# EAGLE design Zaliczeniowy (EAGLE 9.6.2)
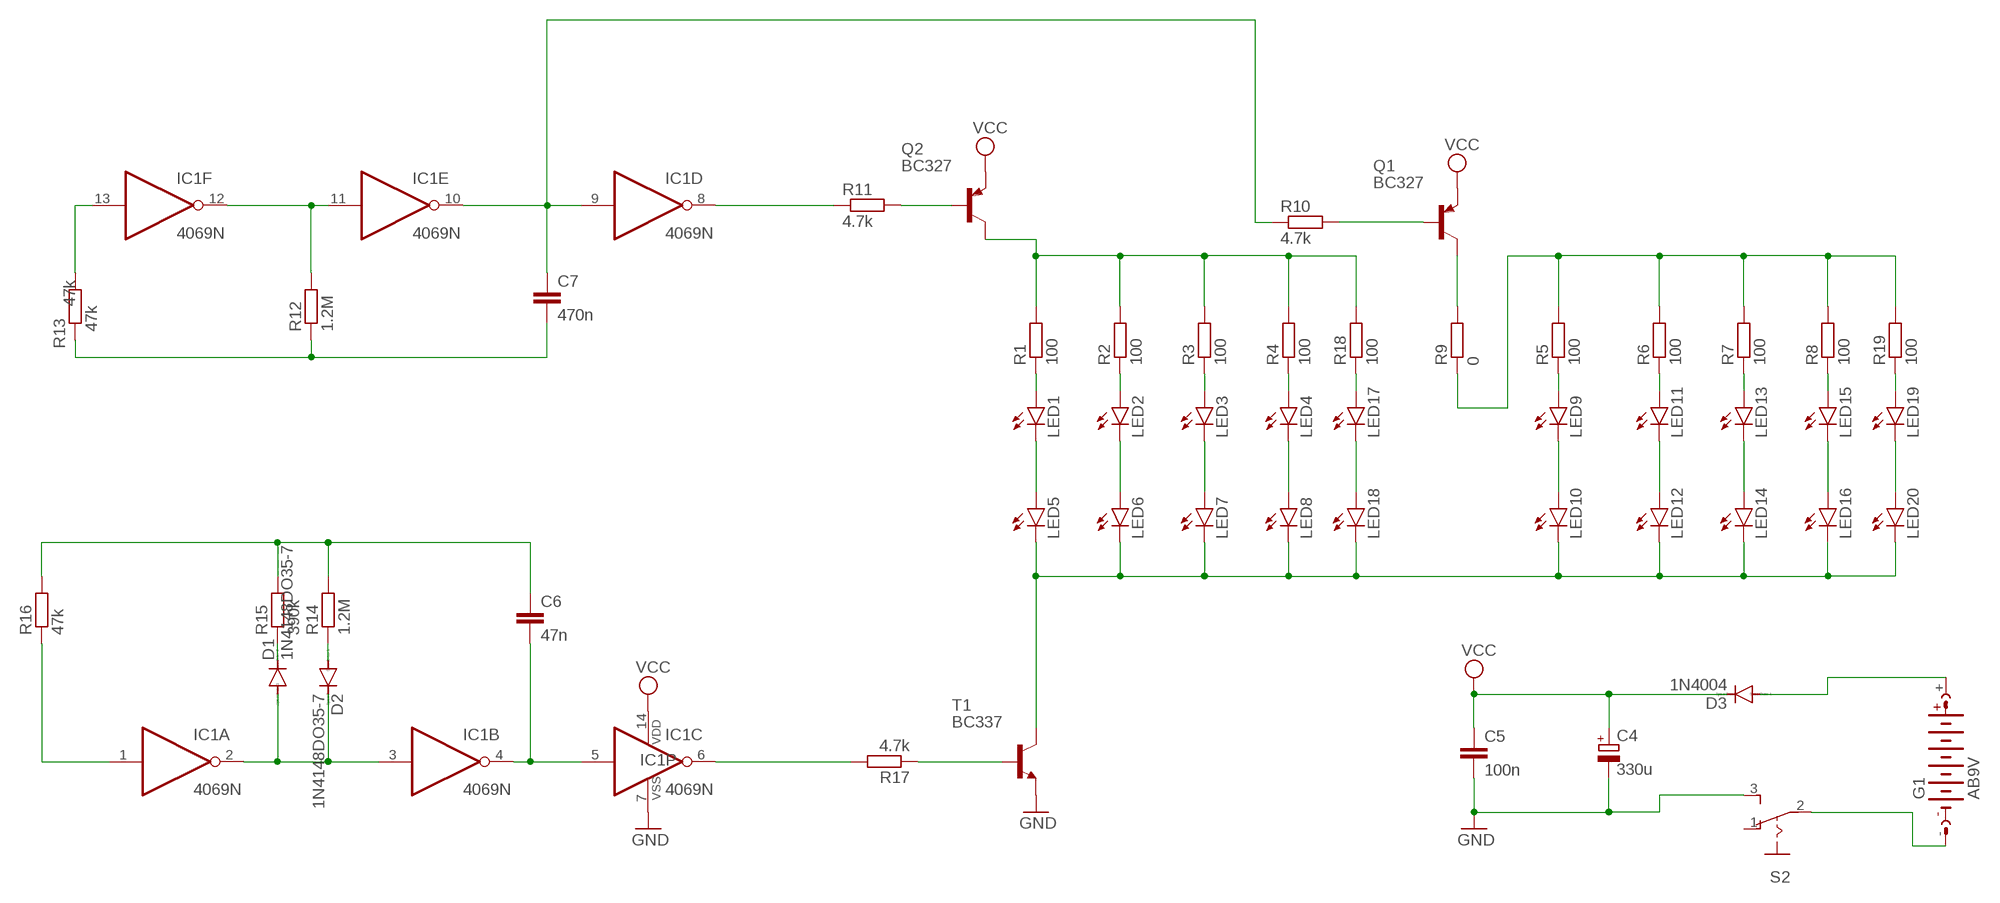
[diagram p0: schematic, sheet 1]

## Parts
C4  330u  CPOL-EUE2-5  [E2-5]
C5  100n  C-EU025-024X044  [C025-024X044]
C6  47n  C-EU025-024X044  [C025-024X044]
C7  470n  C-EU025-024X044  [C025-024X044]
D1  1N4148DO35-7  [DO35-7]
D2  1N4148DO35-7  [DO35-7]
D3  1N4004  [DO41-10]
G1  AB9V  [AB9V]
IC1  4069N  [DIL14]
LED1  LED5MM  [LED5MM]
LED2  LED5MM  [LED5MM]
LED3  LED5MM  [LED5MM]
LED4  LED5MM  [LED5MM]
LED5  LED5MM  [LED5MM]
LED6  LED5MM  [LED5MM]
LED7  LED5MM  [LED5MM]
LED8  LED5MM  [LED5MM]
LED9  LED5MM  [LED5MM]
LED10  LED5MM  [LED5MM]
LED11  LED5MM  [LED5MM]
LED12  LED5MM  [LED5MM]
LED13  LED5MM  [LED5MM]
LED14  LED5MM  [LED5MM]
LED15  LED5MM  [LED5MM]
LED16  LED5MM  [LED5MM]
LED17  LED5MM  [LED5MM]
LED18  LED5MM  [LED5MM]
LED19  LED5MM  [LED5MM]
LED20  LED5MM  [LED5MM]
Q1  BC327  [TO92]
Q2  BC327  [TO92]
R1  100  R-EU_0207/7  [0207/7]
R2  100  R-EU_0207/7  [0207/7]
R3  100  R-EU_0207/7  [0207/7]
R4  100  R-EU_0207/7  [0207/7]
R5  100  R-EU_0207/7  [0207/7]
R6  100  R-EU_0207/7  [0207/7]
R7  100  R-EU_0207/7  [0207/7]
R8  100  R-EU_0207/7  [0207/7]
R9  0  R-EU_0207/7  [0207/7]
R10  4.7k  R-EU_0207/7  [0207/7]
R11  4.7k  R-EU_0207/7  [0207/7]
R12  1.2M  R-EU_0207/7  [0207/7]
R13  47k  R-EU_0207/7  [0207/7]
R14  1.2M  R-EU_0207/7  [0207/7]
R15  390k  R-EU_0207/7  [0207/7]
R16  47k  R-EU_0207/7  [0207/7]
R17  4.7k  R-EU_0207/7  [0207/7]
R18  100  R-EU_0207/7  [0207/7]
R19  100  R-EU_0207/7  [0207/7]
S2  255SB  [255SB]
T1  BC337  BC337-16-NPN-TO92-CBE  [TO92-CBE]

## Nets
+VCC: D3.A G1.+
GND: C4.- C5.2 IC1.7(P:VSS) S2.3(S) T1.E
N$1: LED1.A R1.1
N$2: LED2.A R2.1
N$3: LED3.A R3.1
N$4: LED4.A R4.1
N$5: LED1.K(C) LED5.A
N$6: LED2.K(C) LED6.A
N$7: LED3.K(C) LED7.A
N$8: LED17.A R18.1
N$9: Q2.3(C) R1.2 R2.2 R3.2 R4.2 R18.2
N$10: LED5.K(C) LED6.K(C) LED7.K(C) LED8.K(C) LED10.K(C) LED12.K(C) LED14.K(C) LED16.K(C) LED18.K(C) LED20.K(C) T1.C
N$11: LED9.K(C) LED10.A
N$12: LED11.K(C) LED12.A
N$13: LED13.K(C) LED14.A
N$14: LED15.K(C) LED16.A
N$15: LED15.A R8.1
N$16: LED13.A R7.1
N$17: LED11.A R6.1
N$18: LED9.A R5.1
N$19: R5.2 R6.2 R7.2 R8.2 R9.1 R19.2
N$20: IC1.13(F:I) R13.2
N$21: Q1.3(C) R9.2
N$22: Q1.2(B) R10.2
N$23: IC1.11(E:I) IC1.12(F:O) R12.2
N$24: IC1.1(A:I) R16.1
N$25: C7.1 IC1.9(D:I) IC1.10(E:O) R10.1
N$26: Q2.2(B) R11.2
N$27: IC1.8(D:O) R11.1
N$28: C7.2 R12.1 R13.1
N$29: D1.C R15.1
N$30: D2.A R14.1
N$31: D1.A D2.C IC1.2(A:O) IC1.3(B:I)
N$32: C6.1 R14.2 R15.2 R16.2
N$33: C6.2 IC1.4(B:O) IC1.5(C:I)
N$34: IC1.6(C:O) R17.2
N$35: R17.1 T1.B
N$36: G1.- S2.2(P)
N$37: LED4.K(C) LED8.A
N$38: LED17.K(C) LED18.A
N$39: LED19.A R19.1
N$40: LED19.K(C) LED20.A
VCC: C4.+ C5.1 D3.C IC1.14(P:VDD) Q1.1(E) Q2.1(E)
Unconnected: S2.1(O)

## Library data of the parts
C4 = rcl:CPOL-EU: POLARIZED CAPACITOR, European symbol; SPICEPREFIX: C
C5-C7 = rcl:C-EU: CAPACITOR, European symbol; SPICEPREFIX: C
D1 D2 = diode:1N4148: DIODE high speed (Philips)
D3 = diode:1N4004: DIODE general purpose rectifier, 1 A
G1 = battery:AB9V: 9-V BATTERY CLIP
IC1 = 40xx:4069: Hex INVERTER
LED1-LED20 = led:LED: LED OSRAM: - CHIPLED LG R971, LG N971, LY N971, LG Q971, LY Q971, LO R971, LY R971 LH N974, LH R974 LS Q976, LO Q976, LY Q976 LO Q996 - Hyper CHIPLED LW Q18S LB Q993, LB Q99A, LB R99A - SideLED LS A670, LO A670, LY A670, LG A670, LP A670 LB A673, LV A673, LT A673, LW A673 LH A674 LY A675 LS A676, LA A676, LO A676, LY A676, LW A676 LS A679, LY A679, LG A679 - Hyper Micro SIDELED® LS Y876, LA Y876, LO Y876, LY Y876 LT Y87S - SmartLED LW L88C, LW L88S LB L89C, LB L89S, LG L890 LS L89K, LO L89K, LY L89K LS L896, LA L896, LO L896, LY L896 - TOPLED LS T670, LO T670, LY T670, LG T670, LP T670 LSG T670, LSP T670, LSY T670, LOP T670, LYG T670 LG T671, LOG T671, LSG T671 LB T673, LV T673, LT T673, LW T673 LH T674 LS T676, LA T676, LO T676, LY T676, LB T676, LH T676, LSB T676, LW T676 LB T67C, LV T67C, LT T67C, LS T67K, LO T67K, LY T67K, LW E67C LS E67B, LA E67B, LO E67B, LY E67B, LB E67C, LV E67C, LT E67C LW T67C LS T679, LY T679, LG T679 LS T770, LO T770, LY T770, LG T770, LP T770 LB T773, LV T773, LT T773, LW T773 LH T774 LS E675, LA E675, LY E675, LS T675 LS T776, LA T776, LO T776, LY T776, LB T776 LHGB T686 LT T68C, LB T68C - Hyper Mini TOPLED® LB M676 - Mini TOPLED Santana® LG M470 LS M47K, LO M47K, LY M47K Source: http://www.osram.convergy.de LUXEON: - LUMILED® LXK2-PW12-R00, LXK2-PW12-S00, LXK2-PW14-U00, LXK2-PW14-V00 LXK2-PM12-R00, LXK2-PM12-S00, LXK2-PM14-U00 LXK2-PE12-Q00, LXK2-PE12-R00, LXK2-PE12-S00, LXK2-PE14-T00, LXK2-PE14-U00 LXK2-PB12-K00, LXK2-PB12-L00, LXK2-PB12-M00, LXK2-PB14-N00, LXK2-PB14-P00, LXK2-PB14-Q00 LXK2-PR12-L00, LXK2-PR12-M00, LXK2-PR14-Q00, LXK2-PR14-R00 LXK2-PD12-Q00, LXK2-PD12-R00, LXK2-PD12-S00 LXK2-PH12-R00, LXK2-PH12-S00 LXK2-PL12-P00, LXK2-PL12-Q00, LXK2-PL12-R00 Source: www.luxeon.com KINGBRIGHT: KA-3528ASYC Source: www.kingbright.com
Q1 Q2 = transistor-pnp:BC327: PNP Transistor
R1-R19 = rcl:R-EU_: RESISTOR, European symbol; SPICEPREFIX: R
S2 = switch:255SB: SLIDING SWITCH Distributor Buerklin, 11G810
T1 = transistor:*-NPN-: NPN Transistror BF959 corrected 2008.03.06

## Board
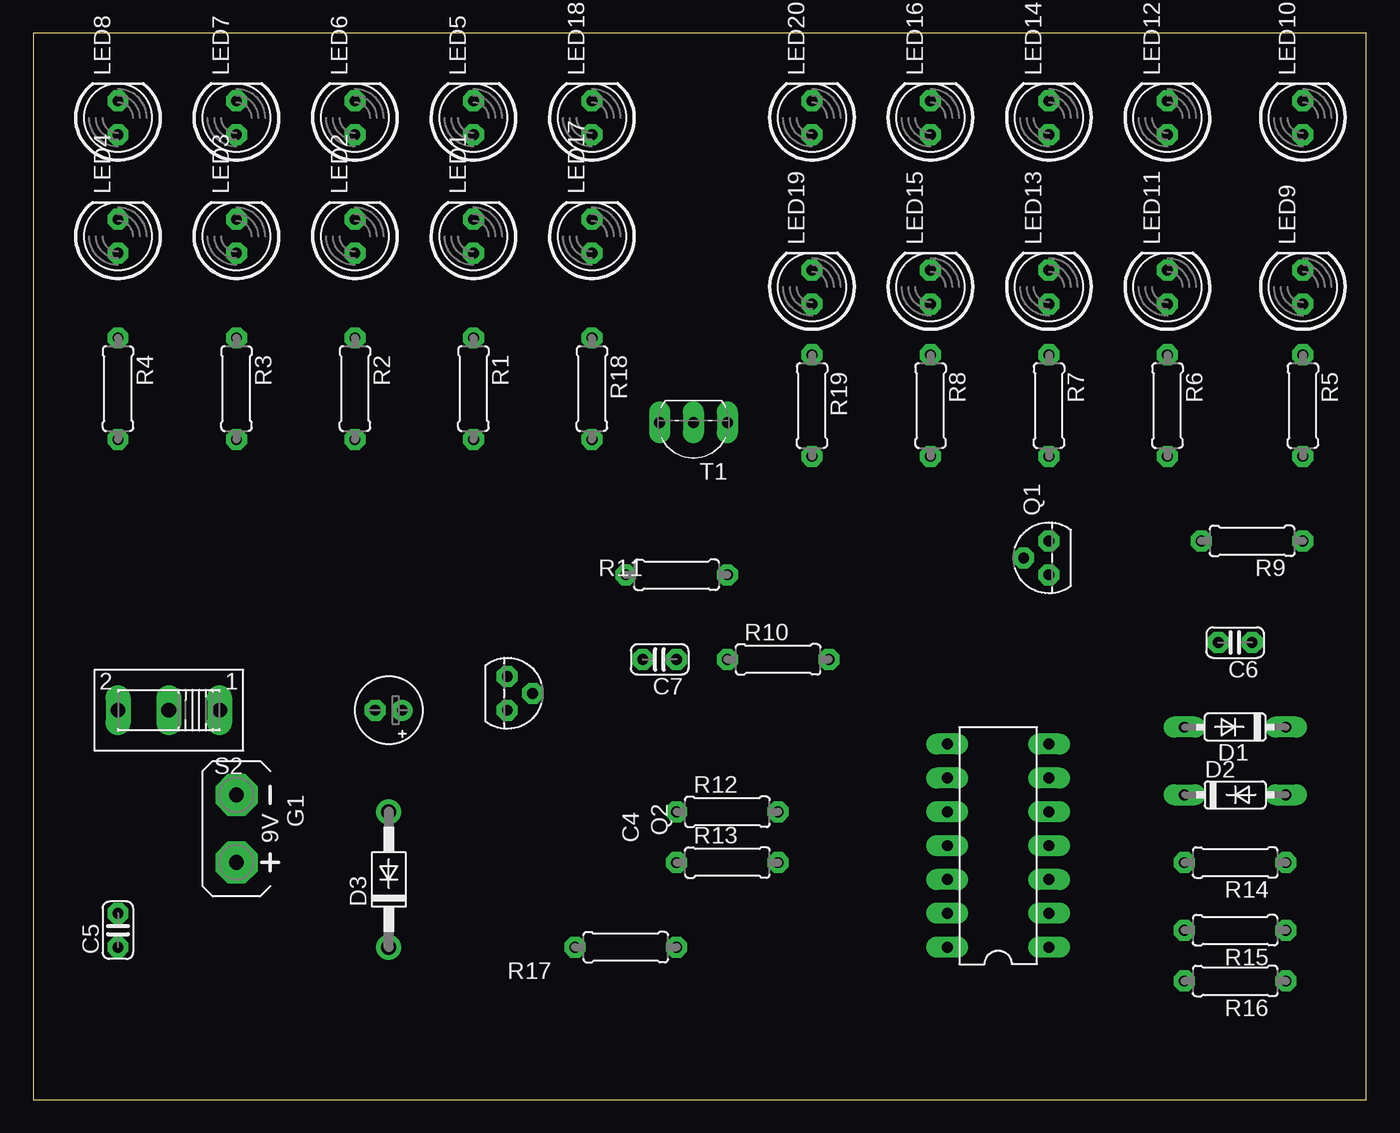
[diagram p1: board, top side]
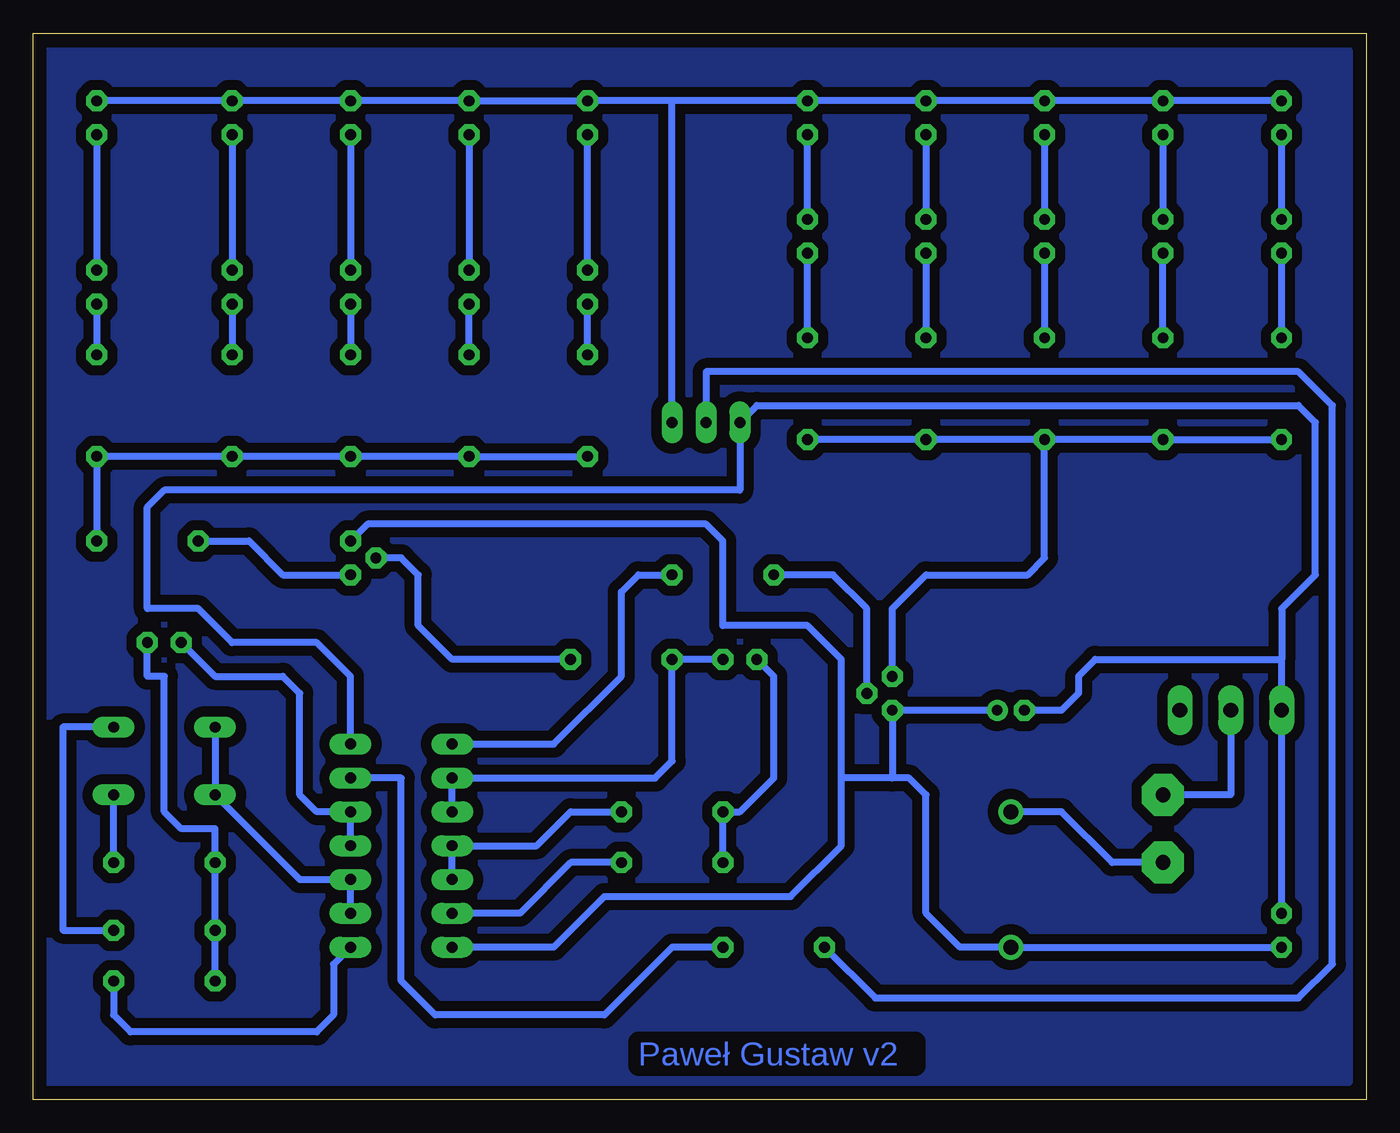
[diagram p2: board, bottom side, seen from below]

Size 100 x 80 mm. Coordinates in mm from the lower left corner, seen from the top.
Outline: 0,0 100,0 100,80 0,80 0,0
Copper layers (1*16): Top 0.035mm / dielectric 1.5mm / Bottom 0.035mm
Design rules "default *": minimum track width 20mil, minimum drill 0.35mm, track to track 30mil, track to pad 30mil, pad to pad 6mil, via to via 6mil, smd to smd 6mil, copper to edge 40mil, drill to drill 6mil, minimum pad ring 15mil, minimum via ring 20mil, stop-mask expansion 15mil, vias tented up to drill 0mil, thermal gap 10mil

### Footprints (pad centres in the part's own frame; a part is rotated, then mirrored left to right if it is on the bottom)
E2-5 = drill 0.813 pad 1.27: + -1.016,0 | drill 0.813 pad 1.27 octagon: - 1.016,0
C025-024X044 = drill 0.813 octagon: 1 -1.27,0; 2 1.27,0
DO35-7 = drill 0.813 long: A 3.81,0; C -3.81,0
DO41-10 = drill 1.118: A 5.08,0; C -5.08,0
AB9V = drill 1.118 pad 3.15 octagon: + 0,2.54; - 0,-2.54
DIL14 = drill 0.813 long: 1 -7.62,-3.81; 2 -5.08,-3.81; 3 -2.54,-3.81; 4 0,-3.81; 5 2.54,-3.81; 6 5.08,-3.81; 7 7.62,-3.81; 8 7.62,3.81; 9 5.08,3.81; 10 2.54,3.81; 11 0,3.81; 12 -2.54,3.81; 13 -5.08,3.81; 14 -7.62,3.81
LED5MM = drill 0.813 octagon: A -1.27,0; K 1.27,0
TO92 = drill 0.813 octagon: 1 1.27,0; 2 0,1.905; 3 -1.27,0
0207/7 = drill 0.813 octagon: 1 -3.81,0; 2 3.81,0
255SB = drill 1.118 long: 1 -3.81,0; 2 0,0; 3 3.81,0
TO92-CBE = drill 0.813 long: B 0,0; C -2.54,0; E 2.54,0

### Placement (x,y rotation side)
C4  26.67,29.21 180 top
C5  6.35,12.7 90 top
C6  90.17,34.29 180 top
C7  46.99,33.02 180 top
D1  90.17,27.94 180 top
D2  90.17,22.86 0 top
D3  26.67,16.51 90 top
G1  15.24,20.32 180 top
IC1  72.39,19.05 90 top
LED1  33.02,64.77 90 top
LED2  24.13,64.77 90 top
LED3  15.24,64.77 90 top
LED4  6.35,64.77 90 top
LED5  33.02,73.66 90 top
LED6  24.13,73.66 90 top
LED7  15.24,73.66 90 top
LED8  6.35,73.66 90 top
LED9  95.25,60.96 90 top
LED10  95.25,73.66 90 top
LED11  85.09,60.96 90 top
LED12  85.09,73.66 90 top
LED13  76.2,60.96 90 top
LED14  76.2,73.66 90 top
LED15  67.31,60.96 90 top
LED16  67.31,73.66 90 top
LED17  41.91,64.77 90 top
LED18  41.91,73.66 90 top
LED19  58.42,60.96 90 top
LED20  58.42,73.66 90 top
Q1  76.2,40.64 90 top
Q2  35.56,30.48 270 top
R1  33.02,53.34 270 top
R2  24.13,53.34 270 top
R3  15.24,53.34 270 top
R4  6.35,53.34 270 top
R5  95.25,52.07 270 top
R6  85.09,52.07 270 top
R7  76.2,52.07 270 top
R8  67.31,52.07 270 top
R9  91.44,41.91 180 top
R10  55.88,33.02 0 top
R11  48.26,39.37 180 top
R12  52.07,21.59 0 top
R13  52.07,17.78 0 top
R14  90.17,17.78 180 top
R15  90.17,12.7 180 top
R16  90.17,8.89 180 top
R17  44.45,11.43 0 top
R18  41.91,53.34 270 top
R19  58.42,52.07 270 top
S2  10.16,29.21 180 top
T1  49.53,50.8 180 top

### Tracks (layer width: path | path; a pad name or v marks a point on that pad's centre or on a via)
+VCC
  Bottom 0.508: G1.+ 19.05,17.78 22.86,21.59 D3.A
GND
  Bottom 0.508: C4.- 22.86,29.21 21.59,30.48 21.59,31.75 20.32,33.02 6.35,33.02 | IC1.7 76.2,31.75 78.74,34.29 85.09,34.29 87.63,36.83 91.44,36.83 91.44,44.45 90.17,45.72 46.99,45.72 T1.E 45.72,52.07 5.08,52.07 3.81,50.8 3.81,39.37 6.35,36.83 6.35,33.02 | C5.2 S2.3 6.35,33.02
KKK
  pour Bottom: 1.27,78.74 1.27,1.27 100.33,1.27 100.33,78.74
N$1
  Bottom 0.508: LED1.A R1.1
N$2
  Bottom 0.508: LED2.A R2.1
N$3
  Bottom 0.508: R3.1 LED3.A
N$4
  Bottom 0.508: R4.1 LED4.A
N$5
  Bottom 0.508: LED5.A LED1.K
N$6
  Bottom 0.508: LED6.A LED2.K
N$7
  Bottom 0.508: LED7.A LED3.K
N$8
  Bottom 0.508: R18.1 LED17.A
N$9
  Bottom 0.508: R2.2 R3.2 R4.2 | R2.2 R1.2 R18.2 | R2.2 24.13,40.64 25.4,39.37 33.02,39.37 35.56,36.83 Q2.3
N$10
  Bottom 0.508: LED10.K LED12.K LED14.K LED16.K LED20.K 52.07,74.93 | T1.C 52.07,74.93 | LED8.K LED7.K LED6.K LED5.K LED18.K 52.07,74.93
N$11
  Bottom 0.508: LED10.A LED9.K
N$12
  Bottom 0.508: LED12.A LED11.K
N$13
  Bottom 0.508: LED14.A LED13.K
N$14
  Bottom 0.508: LED16.A LED15.K
N$15
  Bottom 0.508: R8.1 LED15.A
N$16
  Bottom 0.508: LED13.A R7.1
N$17
  Bottom 0.508: LED11.A R6.1
N$18
  Bottom 0.508: LED9.A R5.1
N$19
  Bottom 0.508: R9.1 R5.2 R6.2 R7.2 R8.2 R19.2
N$20
  Bottom 0.508: R13.2 59.69,17.78 63.5,13.97 IC1.13
N$21
  Bottom 0.508: Q1.3 81.28,39.37 83.82,41.91 R9.2
N$22
  Bottom 0.508: R10.2 68.58,33.02 71.12,35.56 71.12,39.37 72.39,40.64 Q1.2
N$23
  Bottom 0.508: R12.2 59.69,21.59 62.23,19.05 IC1.11 IC1.12
N$24
  Bottom 0.508: IC1.1 77.47,10.16 77.47,6.35 78.74,5.08 92.71,5.08 93.98,6.35 R16.1
N$25
  Bottom 0.508: C7.1 R10.1 52.07,25.4 53.34,24.13 IC1.9 IC1.10
N$26
  Bottom 0.508: Q2.2 37.47,36.83 40.01,39.37 R11.2
N$27
  Bottom 0.508: R11.1 54.61,39.37 55.88,38.1 55.88,31.75 60.96,26.67 IC1.8
N$28
  Bottom 0.508: R13.1 R12.1 46.99,21.59 44.45,24.13 44.45,31.75 C7.2
N$29
  Bottom 0.508: R15.1 97.79,12.7 97.79,27.94 D1.C
N$30
  Bottom 0.508: R14.1 D2.A
N$31
  Bottom 0.508: IC1.2 IC1.3 80.01,16.51 D2.C D1.A
N$32
  Bottom 0.508: R16.2 R15.2 R14.2 86.36,20.32 88.9,20.32 90.17,21.59 90.17,31.75 91.44,31.75 C6.1
N$33
  Bottom 0.508: IC1.4 IC1.5 78.74,21.59 80.01,22.86 80.01,30.48 81.28,31.75 86.36,31.75 C6.2
N$34
  Bottom 0.508: R17.2 52.07,11.43 57.15,6.35 69.85,6.35 72.39,8.89 72.39,24.13 IC1.6
N$35
  Bottom 0.508: R17.1 36.83,7.62 5.08,7.62 2.54,10.16 2.54,52.07 5.08,54.61 49.53,54.61 T1.B
N$36
  Bottom 0.508: S2.2 10.16,22.86 G1.-
N$37
  Bottom 0.508: LED4.K LED8.A
N$38
  Bottom 0.508: LED17.K LED18.A
N$39
  Bottom 0.508: R19.1 LED19.A
N$40
  Bottom 0.508: LED19.K LED20.A
VCC
  Bottom 0.508: 35.56,24.13 Q2.1 C4.+ | 35.56,24.13 39.37,24.13 | 39.37,24.13 39.37,33.02 41.91,35.56 48.26,35.56 48.26,41.91 49.53,43.18 74.93,43.18 Q1.1 | C5.1 D3.C 30.48,11.43 33.02,13.97 33.02,22.86 34.29,24.13 35.56,24.13 | IC1.14 60.96,11.43 57.15,15.24 43.18,15.24 39.37,19.05 39.37,24.13

### Text on the board
Bottom: Paweł Gustaw v2